# Altium schematic sheet disp4x7seg.SchDoc
size 160 x 88 mm; PageSetup: Record=PageOptions|CenterHorizontal=True|CenterVertical=True|PrintScale=1.83|XCorrection=1.00|YCorrection=1.00|PrintKind=0|BorderSize=5000000|LeftOffset=0|BottomOffset=0|Orientation=2|PaperLength=1000|PaperWidth=1000|Scale=100|PaperSource=7|PrintQuality=-4|MediaType=1|DitherType=10|PaperKind=A4 (8.2 x 11.7 in; 210 x 297 mm)|PrintScaleMode=1
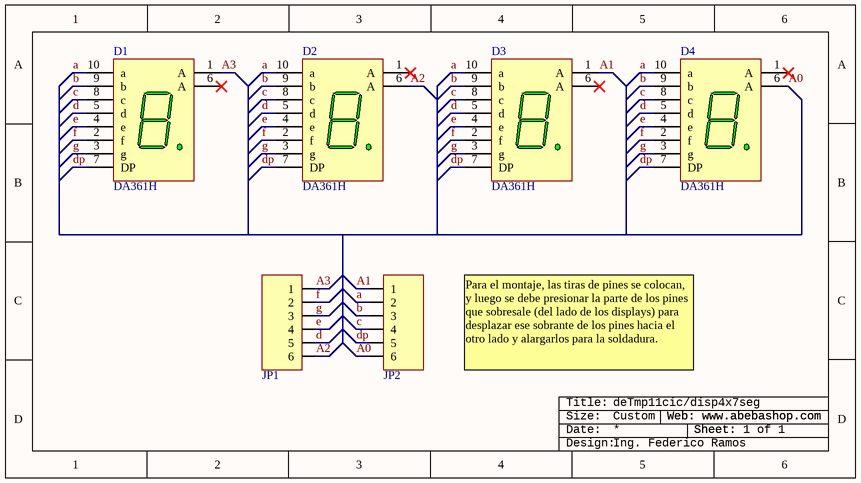
[diagram p0: disp4x7seg.SchDoc]

## Parts
D1  DA361H  [DISP7_2]
D2  DA361H  [DISP7_2]
D3  DA361H  [DISP7_2]
D4  DA361H  [DISP7_2]
JP1  Header6x1  [HDR6x1]  (value not drawn)
JP2  Header6x1  [HDR6x1]  (value not drawn)
ROT?  Rotulo  (value not drawn)  (graphical)

## Nets
a: D1.10(a) D2.10(a) D3.10(a) D4.10(a) JP2.2
A0: D4.6(A) JP2.6
A1: D3.1(A) JP2.1
A2: D2.6(A) JP1.6
A3: D1.1(A) JP1.1
b: D1.9(b) D2.9(b) D3.9(b) D4.9(b) JP2.3
c: D1.8(c) D2.8(c) D3.8(c) D4.8(c) JP2.4
d: D1.5(d) D2.5(d) D3.5(d) D4.5(d) JP1.5
dp: D1.7(DP) D2.7(DP) D3.7(DP) D4.7(DP) JP2.5
e: D1.4(e) D2.4(e) D3.4(e) D4.4(e) JP1.4
f: D1.2(f) D2.2(f) D3.2(f) D4.2(f) JP1.2
g: D1.3(g) D2.3(g) D3.3(g) D4.3(g) JP1.3

Not connected (* = marked no-connect by the designer): D1 6(A)*; D2 1(A)*; D3 6(A)*; D4 1(A)*

## Notes on the sheet
- Para el montaje, las tiras de pines se colocan, y luego se debe presionar la parte de los pines que sobresale (del lado de los displays) para desplazar ese sobrante de los pines hacia el otro lado y alargarlos para la soldadura.
- deTmp11cic/disp4x7seg
- Custom
- (near ROT?) Web: www.abebashop.com
- Sheet: 1 of 1
- Ing. Federico Ramos
- (in symbol Rotulo) Title:; Size:; Web: www.abebashop.com; Date:; Sheet:; Design:

## Library data of the parts
D1-D4 = Display 7 Segmentos Rojo; Anodo Comun; 0.36in; DA361H
JP1 JP2 = Header6x1: Header 6x1; Price: ?
ROT? = Rotulo: Rotulo [consolas]